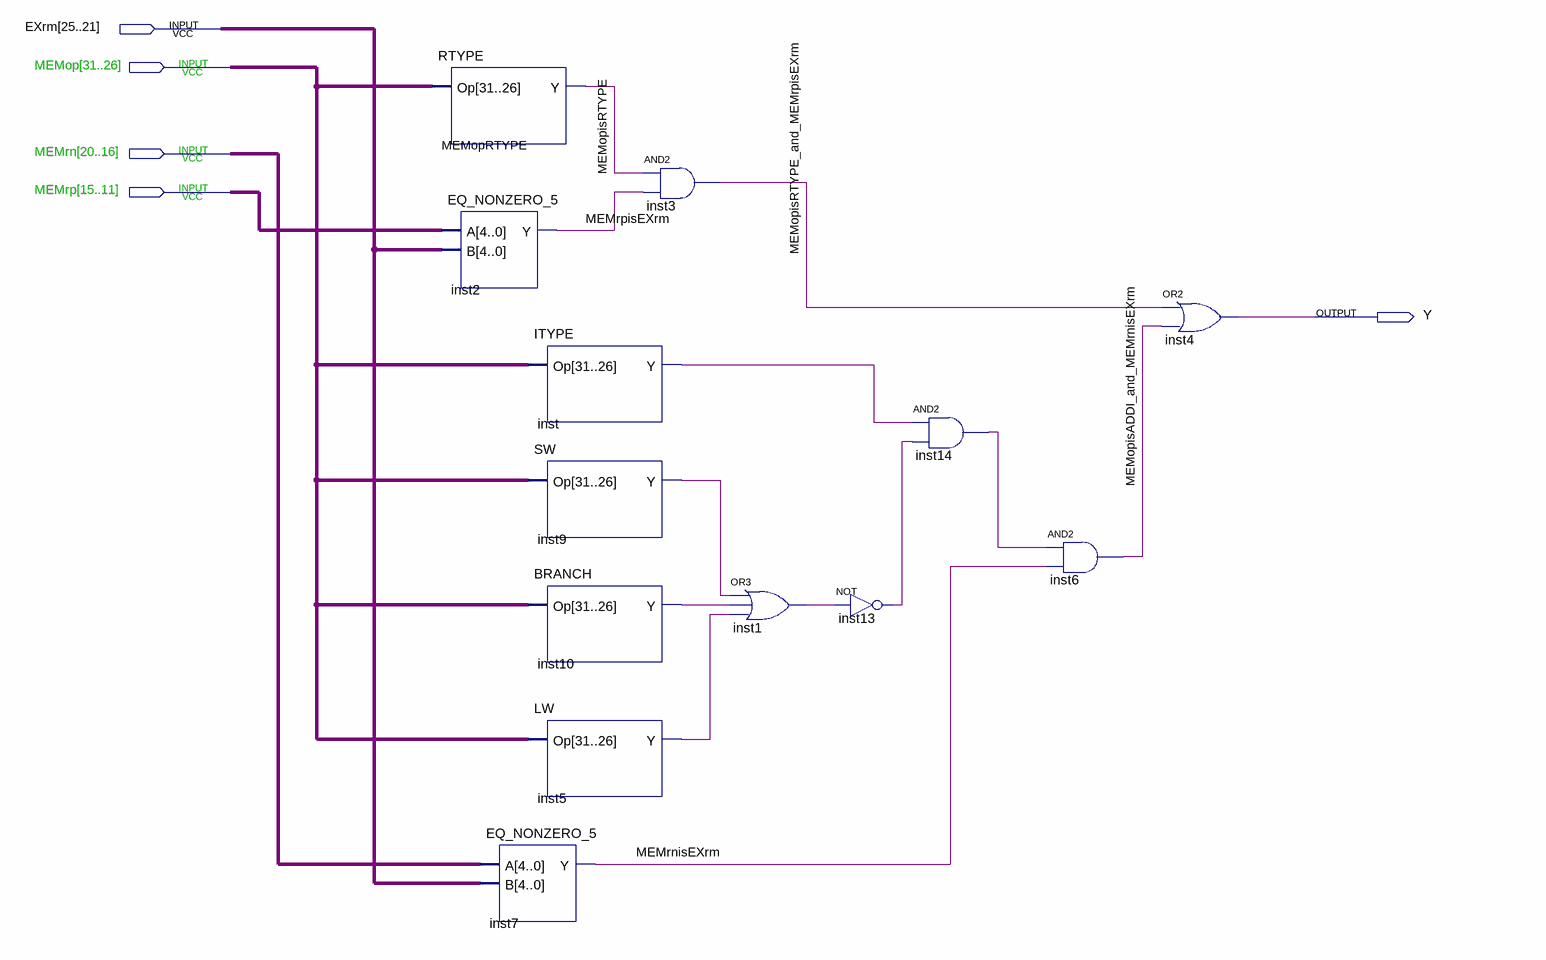
[diagram p0: schematic sheet]
// Quartus schematic ForwardAfromMEMtoEX.bdf as structural Verilog: 13 symbols, 5 pins
module ForwardAfromMEMtoEX (
  input  [25:21] EXrm,
  input  [31:26] MEMop,
  input  [20:16] MEMrn,
  input  [15:11] MEMrp,
  output Y
);

  wire inst1_out, inst5_y, inst9_y, inst10_y, inst13_out, inst14_out, inst_y, MEMopisADDI_and_MEMrnisEXrm,
       MEMopisRTYPE, MEMopisRTYPE_and_MEMrpisEXrm, MEMrnisEXrm, MEMrpisEXrm;

  RTYPE MEMopRTYPE (.Op(MEMop), .Y(MEMopisRTYPE));
  EQ_NONZERO_5 inst2 (.A(MEMrp), .B(EXrm), .Y(MEMrpisEXrm));
  ITYPE inst (.Op(MEMop), .Y(inst_y));
  SW inst9 (.Op(MEMop), .Y(inst9_y));
  BRANCH inst10 (.Op(MEMop), .Y(inst10_y));
  LW inst5 (.Op(MEMop), .Y(inst5_y));
  EQ_NONZERO_5 inst7 (.A(MEMrn), .B(EXrm), .Y(MEMrnisEXrm));
  and inst3 (MEMopisRTYPE_and_MEMrpisEXrm, MEMopisRTYPE, MEMrpisEXrm);
  or inst1 (inst1_out, inst9_y, inst10_y, inst5_y);
  not inst13 (inst13_out, inst1_out);
  and inst14 (inst14_out, inst_y, inst13_out);
  and inst6 (MEMopisADDI_and_MEMrnisEXrm, inst14_out, MEMrnisEXrm);
  or inst4 (Y, MEMopisRTYPE_and_MEMrpisEXrm, MEMopisADDI_and_MEMrnisEXrm);
endmodule
